# Altium project Phototransistor Board.PrjPcb
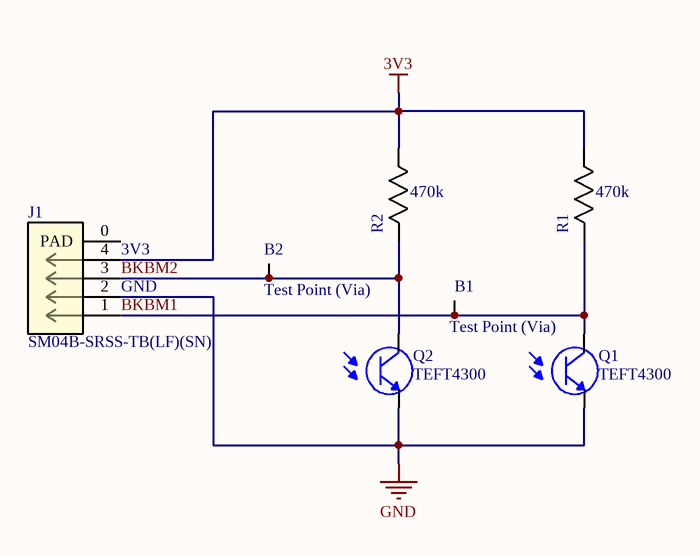
[diagram p0: Phototransistor Board.SchDoc]
1 sheet, 7 parts. Net scope: global (net labels, ports and power ports of the same name join across sheets).
Board file: Phototransistor Board.PcbDoc

## Sheet Phototransistor Board.SchDoc
size A; SheetNumber: 1; SheetTotal: 1

### Parts
B1  Test Point (Via)  [TP]  (no BOM)
B2  Test Point (Via)  [TP]  (no BOM)
J1  SM04B-SRSS-TB(LF)(SN)  [CONN_SM04B_JST]
Q1  TEFT4300  [IRLEDFOOTPRINT]
Q2  TEFT4300  [IRLEDFOOTPRINT]
R1  470k  [0603]
R2  470k  [0603]

### Nets
3V3: J1.4 R1.1(R1) R2.1(R1)
GND: J1.2 Q1.E Q2.E
BKBM1: B1.1 J1.1 Q1.C R1.2(R2)
BKBM2: B2.1 J1.3 Q2.C R2.2(R2)

Not connected (* = marked no-connect by the designer): J1 0(PAD)

### Notes on the sheet
- (near J1) 3V3
- (near J1) GND

### Library data of the parts
J1 = CN HDR 4POS JST SH_SR: CONN HEADER SMD R/A 4POS 1MM; Mfr_Name: JST; Copyright: Copyright (C) 2023 Ultra Librarian. All rights reserved.; Manufacturer_Part_Number: SM04B-SRSS-TB(LF)(SN); Digi-Key_Part_Number_1: 455-1804-2-ND; Digi-Key_Part_Number_2: 455-1804-1-ND; Digi-Key_Part_Number_3: 455-1804-6-ND; RefDes: RefDes; Type: DEV; Part Number: CN HDR 4POS JST SH_SR; Supplier 1: Digi-Key; Supplier Part Number 1: 455-1804-1-ND; Supplier URL 1: https://www.digikey.ca/en/products/detail/jst-sales-america-inc/SM04B-SRSS-TB-LF-SN/926710; Pin Count: 4
Q1 Q2 = TEFT4300: Phototransistor 925nm Top View Radial, 3mm Dia _T-1_; MF: Vishay Semiconductor; MP: TEFT4300; Package: Radial Vishay; Price: None; Availability: Unavailable; Value: *; SnapEDA_Link: https://www.snapeda.com/parts/TEFT4300/Vishay%20Semiconductor%20Opto%20Division/view-part/213585/?ref=snap; Part Number: TEFT4300
R1 R2 = RES 470k 1/8W: Default Resistor Symbol; Power (Watts): 0.125W; Tolerance: 5%; Package: 0805; Value: 470k; Part Number: RES 470k 1/8W
B1 B2 = Test Point (Via): Part Number: Test Point (Via)